# EAGLE design Punktschweis_pulser (EAGLE 7.3.0)
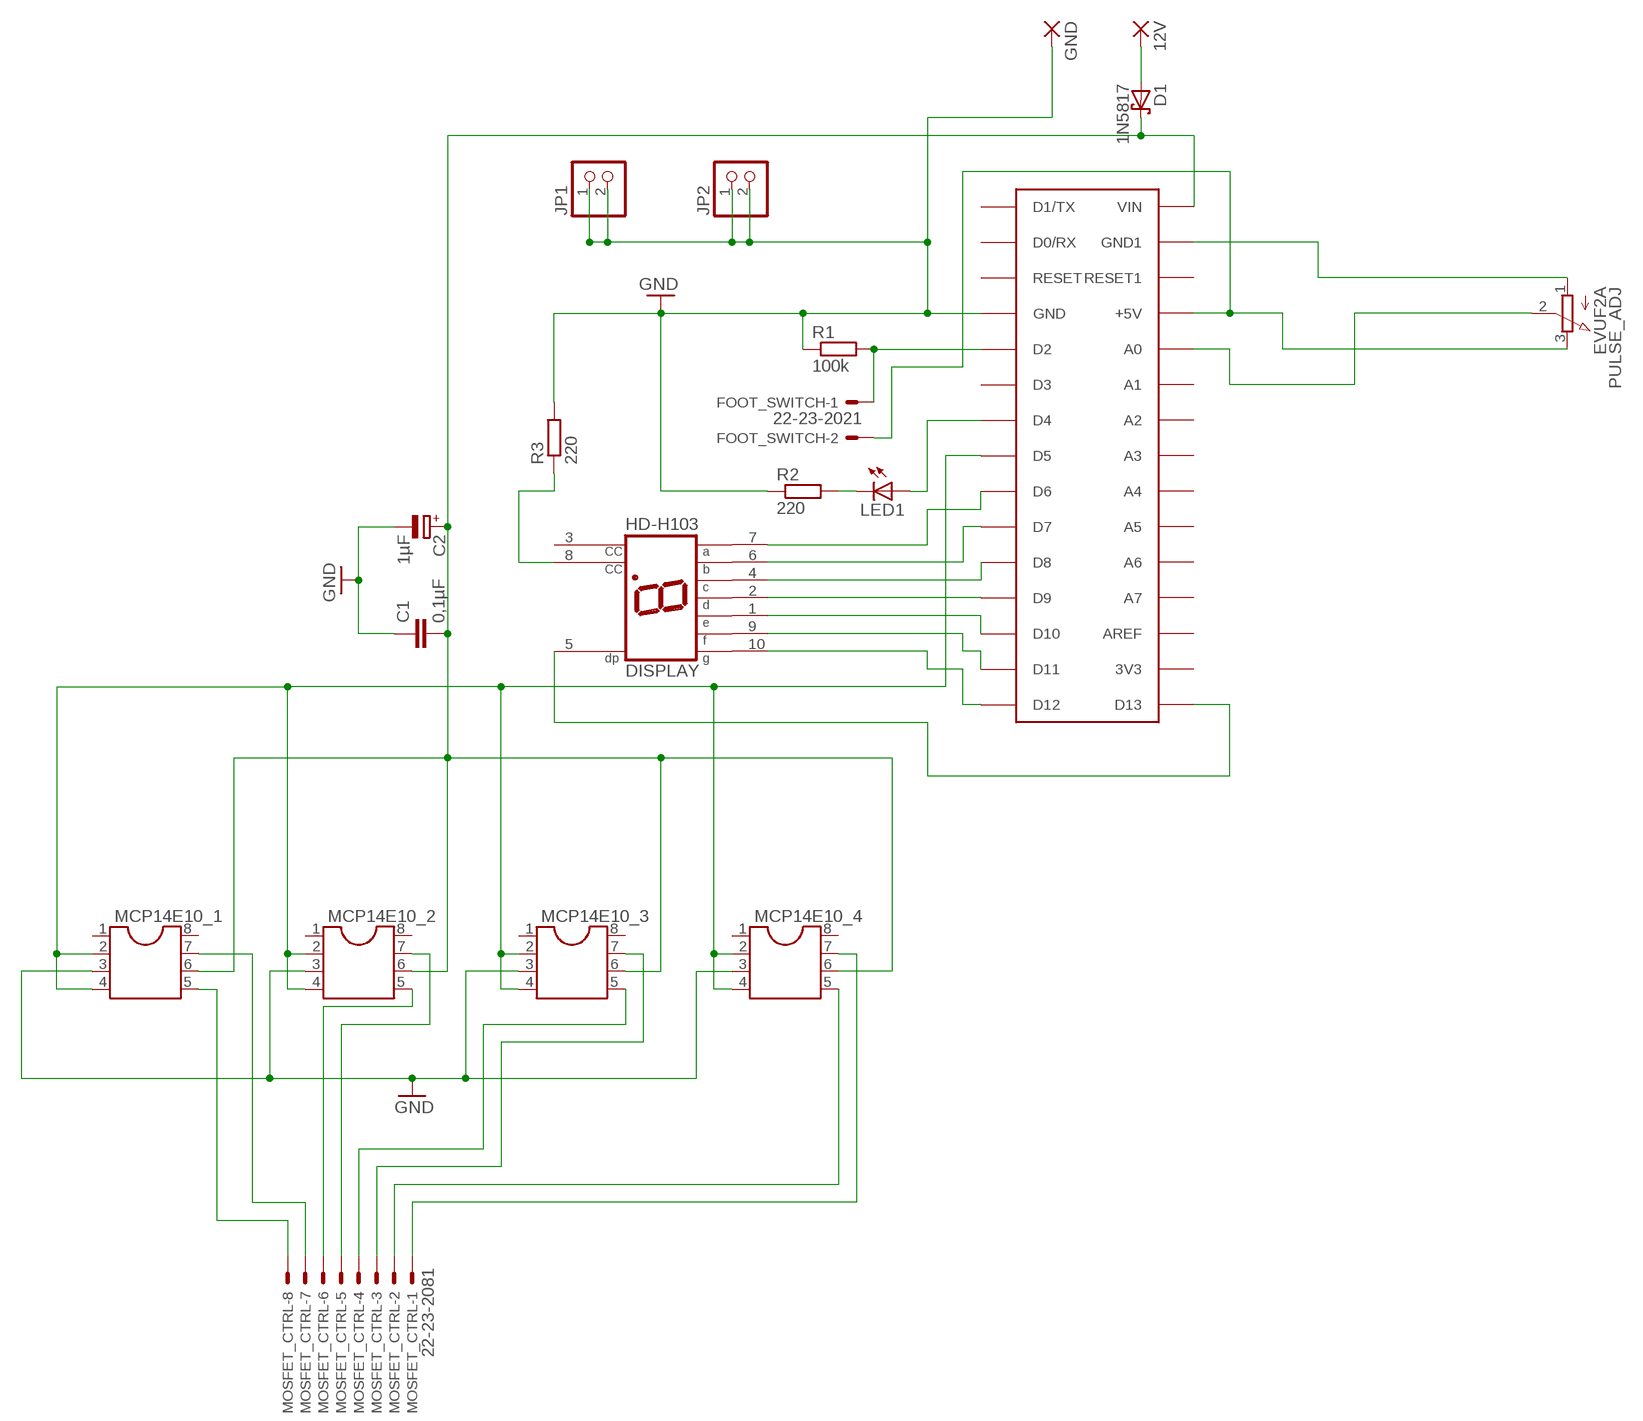
[diagram p0: schematic, sheet 1]

## Parts
12V  2,54/0,8  [2,54/0,8]
C1  0,1µF  C2.5/4  [C2.5-4]
C2  1µF  CPOL-EUE2-5  [E2-5]
D1  1N5817  SCHOTTKY-DIODEDO41  [DO41-10]
DISPLAY  HD-H103  [HDSP-M]
FOOT_SWITCH  22-23-2021  [22-23-2021]
GND  2,54/0,8  [2,54/0,8]
JP1  PINHD-1X2  [1X02]
JP2  PINHD-1X2  [1X02]
LED1  LED5MM  [LED5MM]
MCP14E10_1  DIL8  [DIL08]
MCP14E10_2  DIL8  [DIL08]
MCP14E10_3  DIL8  [DIL08]
MCP14E10_4  DIL8  [DIL08]
MOSFET_CTRL  22-23-2081  [22-23-2081]
PULSE_ADJ  EVUF2A  [EVUF]
R1  100k  R-EU_0207/10  [0207/10]
R2  220  R-EU_0207/10  [0207/10]
R3  220  R-EU_0207/10  [0207/10]
U$1  ARDUINONANO  [PDIP-32]

## Nets
GND: C1.1 C2.- GND.1(P) JP1.1 JP1.2 JP2.1 JP2.2 MCP14E10_1.3 MCP14E10_2.3 MCP14E10_3.3 MCP14E10_4.3 R1.1 R2.1 R3.2 U$1.GND
N$1: DISPLAY.7(A) U$1.D6
N$2: MCP14E10_1.5 MOSFET_CTRL.8
N$3: C1.2 C2.+ D1.C MCP14E10_1.6 MCP14E10_2.6 MCP14E10_3.6 MCP14E10_4.6 U$1.VIN
N$4: PULSE_ADJ.1(A) U$1.GND1
N$5: FOOT_SWITCH.2 PULSE_ADJ.3(E) U$1.+5V
N$6: PULSE_ADJ.2(S) U$1.A0
N$7: FOOT_SWITCH.1 R1.2 U$1.D2
N$8: LED1.K(C) R2.2
N$9: LED1.A U$1.D4
N$10: MCP14E10_1.7 MOSFET_CTRL.7
N$11: MCP14E10_2.5 MOSFET_CTRL.6
N$12: MCP14E10_2.7 MOSFET_CTRL.5
N$13: DISPLAY.6(B) U$1.D7
N$14: MCP14E10_3.5 MOSFET_CTRL.4
N$15: MCP14E10_3.7 MOSFET_CTRL.3
N$16: MCP14E10_4.5 MOSFET_CTRL.2
N$17: MCP14E10_4.7 MOSFET_CTRL.1
N$18: DISPLAY.4(C) U$1.D8
N$19: MCP14E10_1.2 MCP14E10_1.4 MCP14E10_2.2 MCP14E10_2.4 MCP14E10_3.2 MCP14E10_3.4 MCP14E10_4.2 MCP14E10_4.4 U$1.D5
N$20: DISPLAY.2(D) U$1.D9
N$21: DISPLAY.1(E) U$1.D10
N$22: DISPLAY.9(F) U$1.D11
N$23: DISPLAY.10(G) U$1.D12
N$24: DISPLAY.5(DP) U$1.D13
N$25: DISPLAY.8(CC) R3.1
N$26: 12V.1(P) D1.A
Unconnected: DISPLAY.3(CC) MCP14E10_1.1 MCP14E10_1.8 MCP14E10_2.1 MCP14E10_2.8 MCP14E10_3.1 MCP14E10_3.8 MCP14E10_4.1 MCP14E10_4.8 U$1.3V3 U$1.A1 U$1.A2 U$1.A3 U$1.A4 U$1.A5 U$1.A6 U$1.A7 U$1.AREF U$1.D0/RX U$1.D1/TX U$1.D3 U$1.RESET U$1.RESET1

## Library data of the parts
12V GND = wirepad:2,54/0,8: THROUGH-HOLE PAD
C1 = capacitor-wima:C: CAPACITOR naming: grid - package width
C2 = rcl:CPOL-EU: POLARIZED CAPACITOR, European symbol
D1 = adafruit:SCHOTTKY-DIODE: Schottky Diode
DISPLAY = display-hp:HD-H103: LED DISPLAY 1-character 7 segment, decimal point right; OC_FARNELL: unknown; OC_NEWARK: unknown
FOOT_SWITCH = con-molex:22-23-2021: .100" (2.54mm) Center Header - 2 Pin; MF: MOLEX; MPN: 22-23-2021; OC_FARNELL: 1462926; OC_NEWARK: 25C3832
JP1 JP2 = pinhead:PINHD-1X2: PIN HEADER
LED1 = led:LED: LED OSRAM: - CHIPLED LG R971, LG N971, LY N971, LG Q971, LY Q971, LO R971, LY R971 LH N974, LH R974 LS Q976, LO Q976, LY Q976 LO Q996 - Hyper CHIPLED LW Q18S LB Q993, LB Q99A, LB R99A - SideLED LS A670, LO A670, LY A670, LG A670, LP A670 LB A673, LV A673, LT A673, LW A673 LH A674 LY A675 LS A676, LA A676, LO A676, LY A676, LW A676 LS A679, LY A679, LG A679 - Hyper Micro SIDELED® LS Y876, LA Y876, LO Y876, LY Y876 LT Y87S - SmartLED LW L88C, LW L88S LB L89C, LB L89S, LG L890 LS L89K, LO L89K, LY L89K LS L896, LA L896, LO L896, LY L896 - TOPLED LS T670, LO T670, LY T670, LG T670, LP T670 LSG T670, LSP T670, LSY T670, LOP T670, LYG T670 LG T671, LOG T671, LSG T671 LB T673, LV T673, LT T673, LW T673 LH T674 LS T676, LA T676, LO T676, LY T676, LB T676, LH T676, LSB T676, LW T676 LB T67C, LV T67C, LT T67C, LS T67K, LO T67K, LY T67K, LW E67C LS E67B, LA E67B, LO E67B, LY E67B, LB E67C, LV E67C, LT E67C LW T67C LS T679, LY T679, LG T679 LS T770, LO T770, LY T770, LG T770, LP T770 LB T773, LV T773, LT T773, LW T773 LH T774 LS E675, LA E675, LY E675, LS T675 LS T776, LA T776, LO T776, LY T776, LB T776 LHGB T686 LT T68C, LB T68C - Hyper Mini TOPLED® LB M676 - Mini TOPLED Santana® LG M470 LS M47K, LO M47K, LY M47K Source: http://www.osram.convergy.de LUXEON: - LUMILED® LXK2-PW12-R00, LXK2-PW12-S00, LXK2-PW14-U00, LXK2-PW14-V00 LXK2-PM12-R00, LXK2-PM12-S00, LXK2-PM14-U00 LXK2-PE12-Q00, LXK2-PE12-R00, LXK2-PE12-S00, LXK2-PE14-T00, LXK2-PE14-U00 LXK2-PB12-K00, LXK2-PB12-L00, LXK2-PB12-M00, LXK2-PB14-N00, LXK2-PB14-P00, LXK2-PB14-Q00 LXK2-PR12-L00, LXK2-PR12-M00, LXK2-PR14-Q00, LXK2-PR14-R00 LXK2-PD12-Q00, LXK2-PD12-R00, LXK2-PD12-S00 LXK2-PH12-R00, LXK2-PH12-S00 LXK2-PL12-P00, LXK2-PL12-Q00, LXK2-PL12-R00 Source: www.luxeon.com KINGBRIGHT: KA-3528ASYC Source: www.kingbright.com
MCP14E10_1-MCP14E10_4 = ic-package:DIL8: Dual In Line / Socket
MOSFET_CTRL = con-molex:22-23-2081: .100" (2.54mm) Center Header - 8 Pin; MF: MOLEX; MPN: 22-23-2081; OC_FARNELL: 1756826; OC_NEWARK: 01C7592
PULSE_ADJ = pot:EVU: 9 mm Square Rotary Potentiometers Source: Panasonic
R1-R3 = resistor:R-EU_: RESISTOR, European symbol
U$1 = rocketfarm:ARDUINONANO

## Net classes
0 default: clearance 0.205 mm

## Board
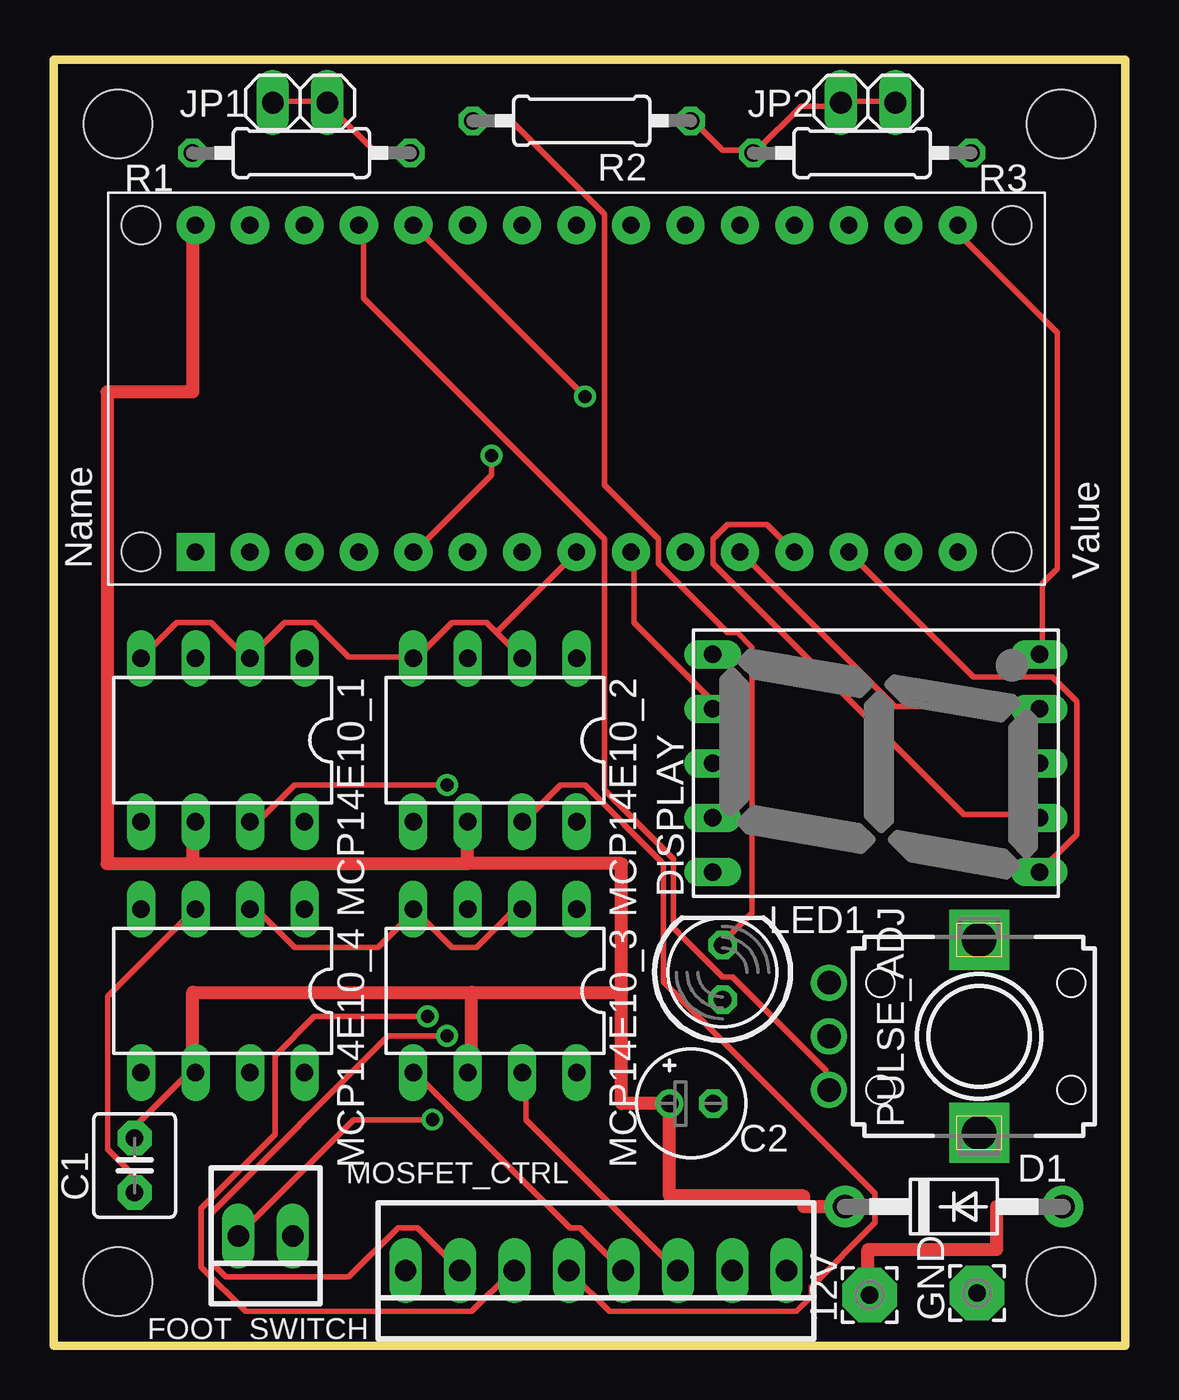
[diagram p1: board, top side]
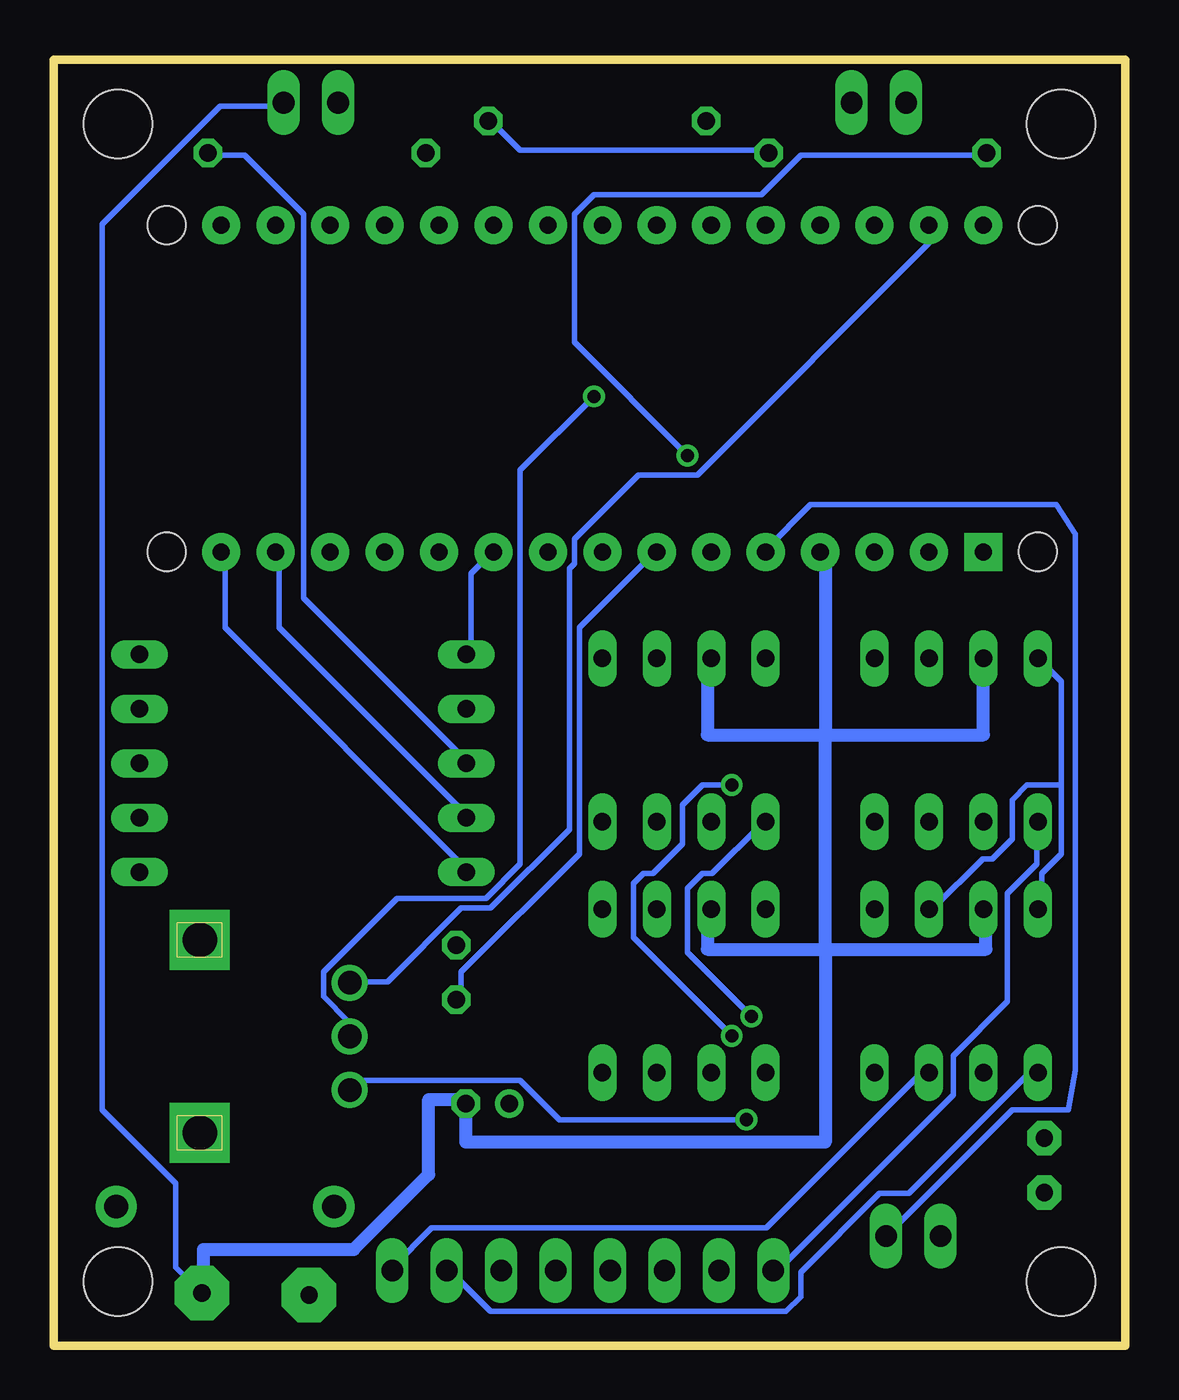
[diagram p2: board, bottom side, seen from below]

Size 50 x 60 mm. Coordinates in mm from the lower left corner, seen from the top.
Outline: 0,0 0,60 50,60 50,0 0,0
Copper layers (1*16): Top 0.035mm / dielectric 1.5mm / Bottom 0.035mm
Design rules "default": minimum track width 10mil, minimum drill 24mil, track to track 8mil, track to pad 8mil, pad to pad 8mil, via to via 8mil, smd to smd 8mil, copper to edge 40mil, drill to drill 8mil, minimum pad ring 10mil, minimum via ring 8mil, stop-mask expansion 4mil, vias tented up to drill 0mil, thermal gap 10mil
Holes 3.2 mm at 47,3 47,57 3,3 3,57

### Footprints (pad centres in the part's own frame; a part is rotated, then mirrored left to right if it is on the bottom)
2,54/0,8 = drill 0.813 pad 2.54 octagon: 1 0,0
C2.5-4 = drill 0.813 pad 1.6 octagon: 1 -1.27,0; 2 1.27,0
E2-5 = drill 0.813 pad 1.27: + -1.016,0 | drill 0.813 pad 1.27 octagon: - 1.016,0
DO41-10 = drill 1.118 pad 1.93: A 5.08,0; C -5.08,0
HDSP-M = drill 0.813 long: 1 -5.08,-7.62; 2 -2.54,-7.62; 3 0,-7.62; 4 2.54,-7.62; 5 5.08,-7.62; 6 5.08,7.62; 7 2.54,7.62; 8 0,7.62; 9 -2.54,7.62; 10 -5.08,7.62
22-23-2021 = drill 1 long: 1 -1.27,0; 2 1.27,0
1X02 = drill 1.016 long: 1 -1.27,0; 2 1.27,0
LED5MM = drill 0.813 octagon: A -1.27,0; K 1.27,0
DIL08 = drill 0.813 long: 1 -3.81,-3.81; 2 -1.27,-3.81; 3 1.27,-3.81; 4 3.81,-3.81; 5 3.81,3.81; 6 1.27,3.81; 7 -1.27,3.81; 8 -3.81,3.81
22-23-2081 = drill 1 long: 1 -8.89,0; 2 -6.35,0; 3 -3.81,0; 4 -1.27,0; 5 1.27,0; 6 3.81,0; 7 6.35,0; 8 8.89,0
EVUF = drill 1.1 pad 1.676: 1 -2.5,-7; 2 0,-7; 3 2.5,-7 | drill 1.6 pad 2.8 square: M1 4.5,0; M2 -4.5,0
0207/10 = drill 0.813 octagon: 1 -5.08,0; 2 5.08,0
PDIP-32 = drill 0.8 pad 1.778: 3V3 15.24,-35.56; +5V 15.24,-10.16; A0 15.24,-12.7; A1 15.24,-15.24; A2 15.24,-17.78; A3 15.24,-20.32; A4 15.24,-22.86; A5 15.24,-25.4; A6 15.24,-27.94; A7 15.24,-30.48; AREF 15.24,-33.02; D0/RX 0,-5.08; D2 0,-12.7; D3 0,-15.24; D4 0,-17.78; D5 0,-20.32; D6 0,-22.86; D7 0,-25.4; D8 0,-27.94; D9 0,-30.48; D10 0,-33.02; D11 0,-35.56; D12 0,-38.1; D13 15.24,-38.1; GND 0,-10.16; GND1 15.24,-5.08; RESET 0,-7.62; RESET1 15.24,-7.62; VIN 15.24,-2.54 | drill 0.8 pad 1.778 square: D1/TX 0,-2.54 | hole 1.778: 0,0; 0,-40.64; 15.24,-40.64; 15.24,0

### Placement (x,y rotation side)
12V  38.08,2.38 90 top
C1  3.78,8.42 90 top
C2  29.75,11.31 0 top
D1  42,6.5 0 top
DISPLAY  38.37,27.18 90 top
FOOT_SWITCH  9.89,5.13 180 top
GND  43.08,2.46 90 top
JP1  11.5,58 0 top
JP2  38,58 0 top
LED1  31.21,17.42 90 top
MCP14E10_1  7.89,28.26 180 top
MCP14E10_2  20.59,28.26 180 top
MCP14E10_3  20.59,16.56 180 top
MCP14E10_4  7.89,16.56 180 top
MOSFET_CTRL  25.31,3.51 180 top
PULSE_ADJ  43.18,14.44 270 top
R1  11.56,55.65 180 top
R2  24.64,57.15 180 top
R3  37.72,55.65 180 top
U$1  4.08,37.04 90 top

### Tracks (layer width: path | path; a pad name or v marks a point on that pad's centre or on a via)
GND
  Top 0.254: C1.1 3.67,7.34 3.67,8.03 2.52,9.18 2.52,16.29 6.43,20.2 MCP14E10_4.3 | R1.1 16.52,55.77 14.92,55.77 12.85,57.83 JP1.2 12.62,58.06 10.33,58.06 JP1.1 | JP2.2 39.24,58.06 36.95,58.06 JP2.1 36.72,57.83 34.88,57.83 32.82,55.77 R3.2 32.59,55.77 31.21,55.77 29.84,57.15 R2.1
  Bottom 0.254: R1.1 16.75,55.77 28.23,55.77 29.61,57.15 R2.1 | GND.1 43.15,2.52 44.29,3.67 44.29,7.57 47.74,11.02 47.74,52.33 42.23,57.83 39.47,57.83 JP2.2
  Bottom 0.61: GND.1 43,2.46 43,4.5 36,4.5 32.5,8 32.5,11.5 30.77,11.5 C2.- 30.77,9.5 14,9.5 14,18.5 | MCP14E10_3.3 19.5,20.37 19.5,18.5 14,18.5 | 14,18.5 6.5,18.5 6.5,20 6.62,20 MCP14E10_4.3 | MCP14E10_2.3 19.5,32.07 19.5,28.5 14,28.5 | 14,28.5 6.62,28.5 MCP14E10_1.3 | U$1.GND 14,37.04 14,28.5 | 14,18.5 14,28.5
N$1
  Top 0.254: DISPLAY.7 30.52,29.84 30.52,30.29 27.08,33.74 27.08,36.95 U$1.D6
N$2
  Bottom 0.254: MCP14E10_1.5 4.13,24.33 4.13,22.49 5.51,21.11 5.51,16.07 8.03,13.54 8.03,11.7 16.29,3.44 MOSFET_CTRL.8
N$3
  Top 0.254: C1.2 3.9,9.87 3.9,10.33 6.2,12.62 MCP14E10_4.6
  Top 0.61: D1.C 35,6.5 35,7 28.73,7 C2.+ 26.5,11.31 26.5,16.5 | 26.5,16.5 26.5,22.5 19.32,22.5 | 19.32,22.5 MCP14E10_2.6 | MCP14E10_1.6 6.5,24.45 6.5,22.5 | 6.5,22.5 19.32,22.5 | MCP14E10_4.6 6.5,12.75 6.5,16.5 19.5,16.5 | 19.5,16.5 26.5,16.5 | MCP14E10_3.6 19.5,12.75 19.5,16.5 | U$1.VIN 6.5,52.28 6.5,44.5 2.5,44.5 2.5,22.5 6.5,22.5
N$4
  Bottom 0.254: PULSE_ADJ.1 36.03,16.98 34.42,16.98 30.98,20.43 29.61,20.43 25.93,24.1 25.93,36.26 25.7,36.49 25.7,37.64 22.72,40.62 19.97,40.62 9.18,51.41 9.18,52.1 U$1.GND1
N$5  (via drill 0.61)
  Top 0.254: v17.67,10.56 14,10.56 8.72,5.28 FOOT_SWITCH.2 | U$1.+5V 14.46,52.1 14.46,48.88 25.7,37.64 25.7,25.93 28.92,22.72 28.92,19.51 31.21,17.21 31.67,17.21 36.03,12.85 36.03,12.16 PULSE_ADJ.3
  Bottom 0.254: v17.67,10.56 26.39,10.56 28.23,12.39 35.8,12.39 36.03,12.16 PULSE_ADJ.3
N$6  (via drill 0.61)
  Top 0.254: v24.79,44.29 16.98,52.1 U$1.A0
  Bottom 0.254: v24.79,44.29 28.23,40.85 28.23,22.49 29.84,20.88 33.97,20.88 37.41,17.44 37.41,16.29 36.26,15.15 36.26,14.46 PULSE_ADJ.2
N$7  (via drill 0.61)
  Top 0.254: v20.43,41.54 20.43,40.62 16.98,37.18 U$1.D2
  Bottom 0.254: v20.43,41.54 25.7,46.82 25.7,52.78 24.79,53.7 16.98,53.7 15.15,55.54 6.66,55.54 R1.2 | FOOT_SWITCH.1 11.02,5.28 5.28,11.02 2.67,11.02 2.34,12.85 2.34,37.87 3.21,39.24 14.69,39.24 16.75,37.18 U$1.D2
N$8
  Top 0.254: R2.2 19.74,57.15 21.34,57.15 25.7,52.78 25.7,40.16 28.23,37.64 28.23,36.49 31.44,33.28 31.9,33.28 32.59,32.59 32.59,20.2 31.21,18.82 LED1.K
N$9
  Bottom 0.254: LED1.A 30.98,16.29 30.98,17.44 25.47,22.95 25.47,33.51 22.03,36.95 U$1.D4
N$10  (via drill 0.61)
  Top 0.254: v18.36,26.16 11.24,26.16 9.64,24.56 9.18,24.56 MCP14E10_1.7 | v18.36,14.46 15.61,14.46 7.34,6.2 7.34,3.9 8.03,3.21 13.77,3.21 16.07,5.51 16.98,5.51 18.82,3.67 MOSFET_CTRL.7
  Bottom 0.254: v18.36,26.16 19.74,26.16 20.66,25.25 20.66,23.41 22.03,22.03 22.49,22.03 22.95,21.57 22.95,19.05 v18.36,14.46
N$11  (via drill 0.61)
  Top 0.254: v17.44,15.38 12.16,15.38 10.33,13.54 10.33,9.87 6.88,6.43 6.88,3.67 8.95,1.61 19.51,1.61 21.34,3.44 MOSFET_CTRL.6
  Bottom 0.254: v17.44,15.38 20.43,18.36 20.43,21.34 19.74,22.03 19.28,22.03 16.98,24.33 MCP14E10_2.5
N$12
  Top 0.254: MCP14E10_2.7 22.03,24.56 23.64,26.16 24.79,26.16 28.46,22.49 28.46,16.98 38.33,7.11 38.33,5.74 35.34,2.75 35.34,2.29 34.65,1.61 25.93,1.61 24.1,3.44 MOSFET_CTRL.5
N$13
  Bottom 0.254: DISPLAY.6 30.52,32.36 30.52,36.03 29.61,36.95 U$1.D7
N$14
  Top 0.254: MCP14E10_3.5 16.98,12.62 24.1,5.51 24.56,5.51 26.39,3.67 MOSFET_CTRL.4
N$15
  Top 0.254: MCP14E10_3.7 22.03,12.62 22.03,10.56 28.92,3.67 MOSFET_CTRL.3
N$16
  Bottom 0.254: MCP14E10_4.5 4.13,12.62 4.59,12.62 10.1,7.11 11.47,7.11 15.15,3.44 15.15,2.29 15.84,1.61 29.61,1.61 31.44,3.44 MOSFET_CTRL.2
N$17
  Bottom 0.254: MCP14E10_4.7 9.18,12.62 9.64,12.62 16.75,5.51 32.36,5.51 34.2,3.67 MOSFET_CTRL.1
N$18
  Top 0.254: DISPLAY.4 45.9,29.84 39.24,29.84 32.13,36.95 U$1.D8
N$19
  Top 0.254: 20.66,33.28 21.8,32.13 MCP14E10_2.2 | 20.66,33.28 20.2,33.74 18.59,33.74 16.98,32.13 MCP14E10_2.4 16.75,32.13 13.77,32.13 12.16,33.74 10.79,33.74 9.18,32.13 MCP14E10_1.2 8.95,32.13 7.34,33.74 5.74,33.74 4.13,32.13 MCP14E10_1.4 | 20.66,33.28 24.33,36.95 U$1.D5 | MCP14E10_4.2 9.18,20.2 9.64,20.2 11.24,18.59 15.15,18.59 16.75,20.2 MCP14E10_3.4 16.98,20.2 18.59,18.59 19.74,18.59 21.34,20.2 21.8,20.2 MCP14E10_3.2
  Bottom 0.254: 2.98,26.16 2.98,30.98 3.9,31.9 MCP14E10_1.4 | 2.98,26.16 2.98,22.95 3.9,22.03 3.9,20.43 MCP14E10_4.4 | 2.98,26.16 4.59,26.16 5.28,25.47 5.28,23.64 6.2,22.72 6.66,22.72 8.95,20.43 MCP14E10_4.2
N$20
  Top 0.254: DISPLAY.2 45.9,24.79 42.46,24.79 30.75,36.49 30.75,37.64 31.44,38.33 33.28,38.33 34.42,37.18 U$1.D9
N$21
  Top 0.254: DISPLAY.1 46.13,22.26 47.74,23.87 47.74,30.06 46.59,31.21 42.92,31.21 37.18,36.95 U$1.D10
N$22
  Bottom 0.254: DISPLAY.9 30.75,24.79 39.47,33.51 39.47,36.95 U$1.D11
N$23
  Bottom 0.254: DISPLAY.10 30.75,22.26 42,33.51 42,36.95 U$1.D12
N$24
  Top 0.254: DISPLAY.5 46.13,32.36 46.13,35.57 46.82,36.26 46.82,47.28 42,52.1 U$1.D13
N$25
  Bottom 0.254: DISPLAY.8 30.75,27.31 38.33,34.88 38.33,52.78 41.08,55.54 42.69,55.54 R3.1
N$26
  Top 0.61: 12V.1 38,2.38 38,4.5 44,4.5 44,6.5 D1.A